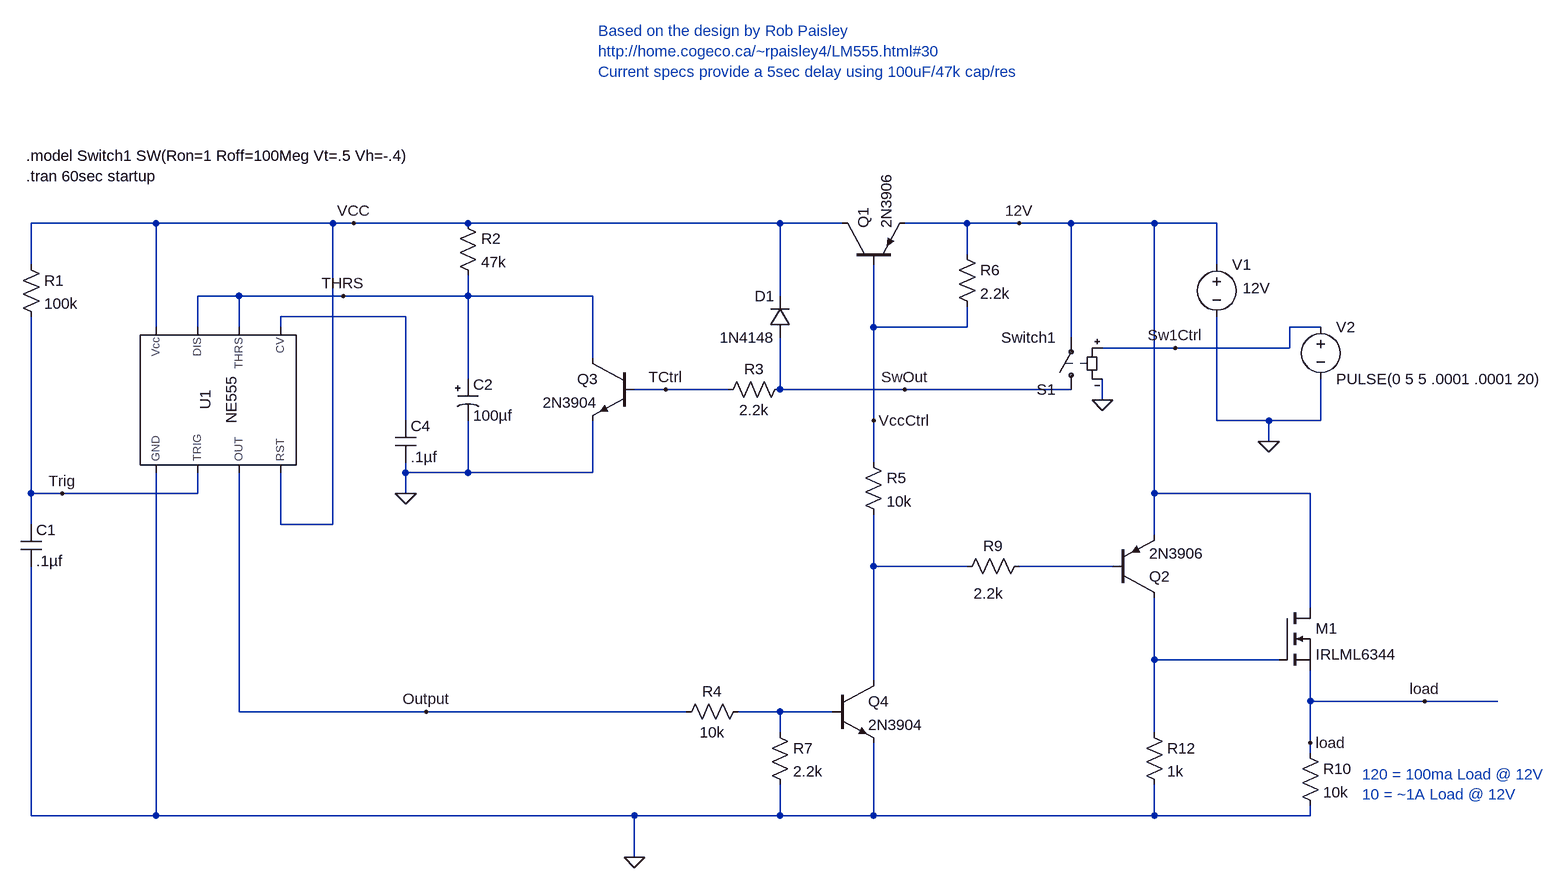
[diagram p0: schematic delaytimer.asc]
delaytimer.asc, the LTspice schematic file:
Version 4
SHEET 1 936 808
WIRE -1728 -320 -1920 -320
WIRE -1456 -320 -1728 -320
WIRE -1424 -320 -1456 -320
WIRE -1248 -320 -1424 -320
WIRE -768 -320 -1248 -320
WIRE -672 -320 -768 -320
WIRE -480 -320 -576 -320
WIRE -400 -320 -480 -320
WIRE -320 -320 -400 -320
WIRE -192 -320 -320 -320
WIRE -96 -320 -192 -320
WIRE -480 -272 -480 -320
WIRE -1920 -256 -1920 -320
WIRE -96 -256 -96 -320
WIRE -1600 -208 -1664 -208
WIRE -1440 -208 -1600 -208
WIRE -1248 -208 -1248 -240
WIRE -1248 -208 -1440 -208
WIRE -1056 -208 -1248 -208
WIRE -768 -208 -768 -320
WIRE -1344 -176 -1536 -176
WIRE -1728 -160 -1728 -320
WIRE -1664 -160 -1664 -208
WIRE -1600 -160 -1600 -208
WIRE -1536 -160 -1536 -176
WIRE -624 -160 -624 -256
WIRE -480 -160 -480 -192
WIRE -480 -160 -624 -160
WIRE 64 -160 16 -160
WIRE -320 -144 -320 -320
WIRE -160 -128 -272 -128
WIRE 16 -128 16 -160
WIRE 16 -128 -160 -128
WIRE -1056 -112 -1056 -208
WIRE -1248 -80 -1248 -208
WIRE -944 -64 -992 -64
WIRE -848 -64 -944 -64
WIRE -768 -64 -768 -144
WIRE -576 -64 -768 -64
WIRE -320 -64 -576 -64
WIRE -272 -48 -272 -80
WIRE -1344 -16 -1344 -176
WIRE -624 -16 -624 -160
WIRE -96 -16 -96 -176
WIRE -16 -16 -96 -16
WIRE 64 -16 64 -80
WIRE 64 -16 -16 -16
WIRE -16 16 -16 -16
WIRE -624 48 -624 -16
WIRE -1344 64 -1344 48
WIRE -1248 64 -1248 -16
WIRE -1248 64 -1344 64
WIRE -1056 64 -1056 -16
WIRE -1056 64 -1248 64
WIRE -1920 96 -1920 -176
WIRE -1872 96 -1920 96
WIRE -1664 96 -1664 64
WIRE -1664 96 -1872 96
WIRE -1344 96 -1344 64
WIRE -192 96 -192 -320
WIRE 48 96 -192 96
WIRE -1920 144 -1920 96
WIRE -1536 144 -1536 64
WIRE -1456 144 -1456 -320
WIRE -1456 144 -1536 144
WIRE -192 160 -192 96
WIRE -624 208 -624 128
WIRE -480 208 -624 208
WIRE -256 208 -400 208
WIRE 48 272 48 96
WIRE -192 352 -192 256
WIRE 0 352 -192 352
WIRE -624 384 -624 208
WIRE 48 416 48 368
WIRE 224 416 48 416
WIRE 336 416 224 416
WIRE -1600 432 -1600 64
WIRE -1312 432 -1600 432
WIRE -912 432 -1312 432
WIRE -768 432 -832 432
WIRE -688 432 -768 432
WIRE -768 464 -768 432
WIRE -192 464 -192 352
WIRE 48 480 48 416
WIRE 48 496 48 480
WIRE -1920 592 -1920 208
WIRE -1728 592 -1728 64
WIRE -1728 592 -1920 592
WIRE -992 592 -1728 592
WIRE -768 592 -768 544
WIRE -768 592 -992 592
WIRE -624 592 -624 480
WIRE -624 592 -768 592
WIRE -192 592 -192 544
WIRE -192 592 -624 592
WIRE 48 592 48 576
WIRE 48 592 -192 592
WIRE -992 656 -992 592
FLAG -992 656 0
FLAG -1344 96 0
FLAG -1440 -208 THRS
FLAG -1312 432 Output
FLAG -16 16 0
FLAG -1424 -320 VCC
FLAG -400 -320 12V
FLAG -160 -128 Sw1Ctrl
FLAG -576 -64 SwOut
FLAG -944 -64 TCtrl
FLAG -1872 96 Trig
FLAG -624 -16 VccCtrl
FLAG -272 -48 0
FLAG 48 480 load
FLAG 224 416 load
SYMBOL Misc/NE555 -1632 -48 R270
SYMATTR InstName U1
SYMBOL voltage -96 -272 R0
WINDOW 3 40 52 Left 2
SYMATTR Value 12V
SYMATTR InstName V1
SYMBOL res -1936 -272 R0
SYMATTR InstName R1
SYMATTR Value 100k
SYMBOL cap -1936 144 R0
SYMATTR InstName C1
SYMATTR Value .1µf
SYMBOL res -1264 -336 R0
SYMATTR InstName R2
SYMATTR Value 47k
SYMBOL pnp -672 -256 R270
SYMATTR InstName Q1
SYMATTR Value 2N3906
SYMBOL pnp -256 256 M180
SYMATTR InstName Q2
SYMATTR Value 2N3906
SYMBOL npn -992 -112 M0
SYMATTR InstName Q3
SYMATTR Value 2N3904
SYMBOL polcap -1264 -80 R0
SYMATTR InstName C2
SYMATTR Value 100µf
SYMBOL res -752 -80 R90
WINDOW 0 0 56 VBottom 2
WINDOW 3 32 56 VTop 2
SYMATTR InstName R3
SYMATTR Value 2.2k
SYMBOL res -816 416 R90
WINDOW 0 0 56 VBottom 2
WINDOW 3 32 56 VTop 2
SYMATTR InstName R4
SYMATTR Value 10k
SYMBOL npn -688 384 R0
SYMATTR InstName Q4
SYMATTR Value 2N3904
SYMBOL res -384 192 R90
WINDOW 0 0 56 VBottom 2
WINDOW 3 42 63 VTop 2
SYMATTR InstName R9
SYMATTR Value 2.2k
SYMBOL diode -752 -144 R180
WINDOW 0 24 64 Left 2
WINDOW 3 24 0 Left 2
SYMATTR InstName D1
SYMATTR Value 1N4148
SYMBOL sw -320 -48 R180
SYMATTR InstName S1
SYMATTR Value Switch1
SYMBOL voltage 64 -176 R0
SYMATTR InstName V2
SYMATTR Value PULSE(0 5 5 .0001 .0001 20)
SYMBOL cap -1360 -16 R0
SYMATTR InstName C4
SYMATTR Value .1µf
SYMBOL res -640 32 R0
SYMATTR InstName R5
SYMATTR Value 10k
SYMBOL res -496 -288 R0
SYMATTR InstName R6
SYMATTR Value 2.2k
SYMBOL res -784 448 R0
SYMATTR InstName R7
SYMATTR Value 2.2k
SYMBOL nmos 0 272 R0
SYMATTR InstName M1
SYMATTR Value IRLML6344
SYMBOL res 32 480 R0
SYMATTR InstName R10
SYMATTR Value 10k
SYMBOL res -208 448 R0
SYMATTR InstName R12
SYMATTR Value 1k
TEXT -1928 -424 Left 2 !.model Switch1 SW(Ron=1 Roff=100Meg Vt=.5 Vh=-.4)\n.tran 60sec startup
TEXT -1048 -616 Left 2 ;Based on the design by Rob Paisley\nhttp://home.cogeco.ca/~rpaisley4/LM555.html#30\nCurrent specs provide a 5sec delay using 100uF/47k cap/res
TEXT 128 528 Left 2 ;120 = 100ma Load @ 12V\n10 = ~1A Load @ 12V

The netlist it stands for:
* delaytimer.asc
XU1 0 Trig Output VCC N001 THRS THRS VCC NE555  ; pins GND TRIG OUT RST CV THRS DIS Vcc
V1 12V 0 12V
R1 VCC Trig 100k
C1 Trig 0 .1µf
R2 VCC THRS 47k
Q1 VCC VccCtrl 12V 0 2N3906
Q2 N004 N003 12V 0 2N3906
Q3 THRS TCtrl 0 0 2N3904
C2 THRS 0 100µf
R3 SwOut TCtrl 2.2k
R4 N005 Output 10k
Q4 N002 N005 0 0 2N3904
R9 N003 N002 2.2k
D1 SwOut VCC 1N4148
S1 SwOut 12V Sw1Ctrl 0 Switch1
V2 Sw1Ctrl 0 PULSE(0 5 5 .0001 .0001 20)
C4 N001 0 .1µf
R5 VccCtrl N002 10k
R6 12V VccCtrl 2.2k
R7 N005 0 2.2k
M1 12V N004 load load IRLML6344
R10 load 0 10k
R12 N004 0 1k
.model D D
.lib standard.dio
.model NPN NPN
.model PNP PNP
.lib standard.bjt
.model NMOS NMOS
.model PMOS PMOS
.lib standard.mos
.model Switch1 SW(Ron=1 Roff=100Meg Vt=.5 Vh=-.4)
.tran 60sec startup
* Based on the design by Rob Paisley
* http://home.cogeco.ca/~rpaisley4/LM555.html#30
* Current specs provide a 5sec delay using 100uF/47k cap/res
* 120 = 100ma Load @ 12V
* 10 = ~1A Load @ 12V
.lib NE555.sub
.backanno
.end